# EAGLE design SensorManager (EAGLE 6.3)
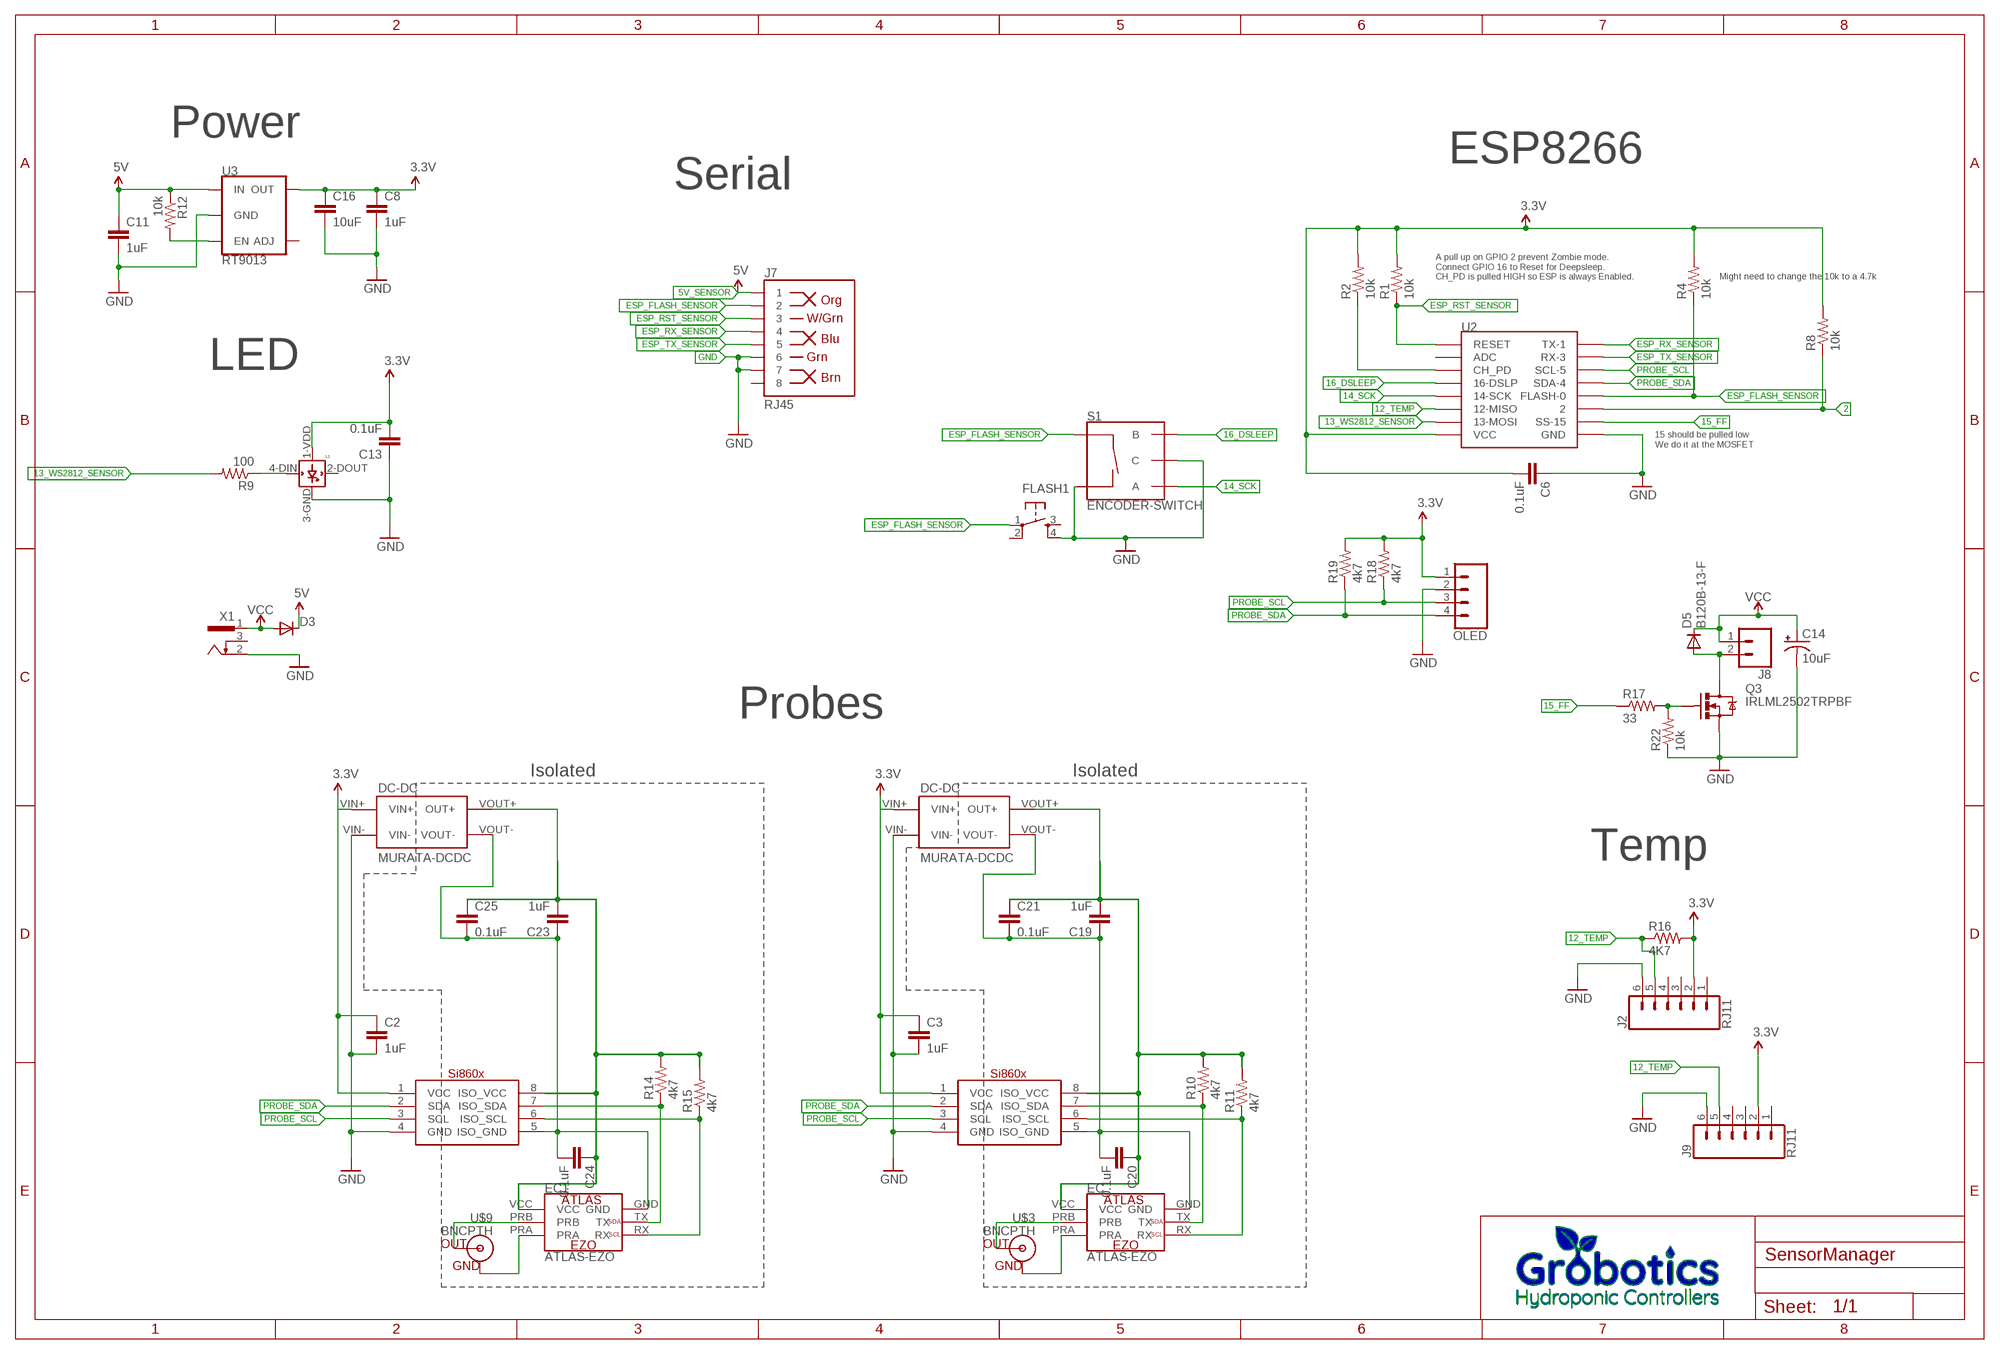
[diagram p0: schematic, sheet 1]

## Parts
C2  1uF  CAP0805  [0805]
C3  1uF  CAP0805  [0805]
C6  0.1uF  CAP0805  [0805]
C8  1uF  CAP0805  [0805]
C11  1uF  CAP0805  [0805]
C13  0.1uF  CAP0805  [0805]
C14  10uF  CPOL-US153CLV-0405  [153CLV-0405]
C16  10uF  CAP0805  [0805]
C19  1uF  CAP0805  [0805]
C20  0.1uF  CAP0805  [0805]
C21  0.1uF  CAP0805  [0805]
C23  1uF  CAP0805  [0805]
C24  0.1uF  CAP0805  [0805]
C25  0.1uF  CAP0805  [0805]
D3  DIODESOD  [SOD-323]
D5  B120B-13-F  DIODESMB  [SMB-DIODE]
EC  ATLAS-EZO  [ATLAS-EZO]
EC1  ATLAS-EZO  [ATLAS-EZO]
FLASH1  TAC_SWITCHSMD  [TACTILE_SWITCH_SMD]
J2  RJ11  RJ11-6  [RJ11-6]
J7  RJ45  RJ45-8  [RJ45-8]
J8  CONN_02  [1X02]
J9  RJ11  RJ11-6  [RJ11-6]
L1  WS2812B  [WS2812B]
OLED  CONN_04  [1X04]
Q3  IRLML2502TRPBF  MOSFET-NCHANNELSMD  [SOT23-3]
R1  10k  RESISTOR0805  [0805]
R2  10k  RESISTOR0805  [0805]
R4  10k  RESISTOR0805  [0805]
R8  10k  RESISTOR0805  [0805]
R9  100  RESISTOR0805  [0805]
R10  4k7  RESISTOR0805-RES  [0805]
R11  4k7  RESISTOR0805-RES  [0805]
R12  10k  RESISTOR0805  [0805]
R14  4k7  RESISTOR0805-RES  [0805]
R15  4k7  RESISTOR0805-RES  [0805]
R16  4K7  RESISTOR0805-RES  [0805]
R17  33  RESISTOR0805  [0805]
R18  4k7  RESISTOR0805  [0805]
R19  4k7  RESISTOR0805  [0805]
R22  10k  RESISTOR0805  [0805]
S1  ENCODER-SWITCH  [ROTARY_ENC_PLAIN]
U2  ESP12SMD  [ESP12-SMD]
U3  RT9013  AP2202-ADJ  [SOT23-5]
U$3  BNCPTH  [BNC]
U$4  MURATA-DCDC  [MURATA_DCDC]
U$8  SI860X  [SO08]
U$9  BNCPTH  [BNC]
U$11  SI860X  [SO08]
U$12  LOGO_GROBOTICS  [GROBOTICS]
U$14  MURATA-DCDC  [MURATA_DCDC]
X1  733980-62  [733980-62]

## Nets
2: R8.1 U2.GPIO2
3.3V: C2.1 C3.1 C6.2 C8.1 C13.2 C16.1 J2.2 J9.2 L1.1-VDD(VDD) OLED.1 R1.2 R2.2 R4.2 R8.2 R16.2 R18.2 R19.2 U2.VCC U3.5(OUT) U$4.VIN+ U$8.1(VCC) U$11.1(VCC) U$14.VIN+
5V_SENSOR: C11.1 D3.1(C) J7.1 R12.1 U3.1(IN) ; supply symbol labelled 5V
12_TEMP: J2.5 J9.5 R16.1 U2.GPIO12(12-MISO)
13_WS2812_SENSOR: R9.2 U2.GPIO13(13-MOSI)
14_SCK: S1.A U2.GPIO14(14-SCK)
15_FF: R17.1 U2.GPIO15(SS-15)
16_DSLEEP: S1.B U2.GPIO16(16-DSLP)
ESP_FLASH_SENSOR: FLASH1.1 J7.2 R4.1 S1.SW+ U2.GPIO0(FLASH-0)
ESP_RST_SENSOR: J7.3 R1.1 U2.RESET
ESP_RX_SENSOR: J7.4 U2.TXD0(TX-1)
ESP_TX_SENSOR: J7.5 U2.RXD0(RX-3)
GND: C2.2 C3.2 C6.1 C8.2 C11.2 C13.1 C14.- C16.2 FLASH1.4 J2.6 J7.6 J7.7 J9.6 L1.3-GND(GND) OLED.2 Q3.2(S) R22.1 S1.C S1.SW- U2.GND U3.2(GND) U$4.VIN- U$8.4(GND) U$11.4(GND) U$14.VIN- X1.2
N$2: EC.PRB U$3.S(OUT)
N$4: EC1.PRB U$9.S(OUT)
N$5: EC1.PRA U$9.GND
N$6: EC1.RX R15.1 U$11.6(ISO_SCL)
N$7: EC1.TX R14.1 U$11.7(ISO_SDA)
N$8: EC.PRA U$3.GND
N$10: R2.1 U2.CH_PD
N$11: L1.4-DIN(DIN) R9.1
N$12: EC.RX R11.1 U$8.6(ISO_SCL)
N$13: R12.2 U3.3(EN)
N$14: EC.TX R10.1 U$8.7(ISO_SDA)
N$15: C19.1 C20.2 C21.2 EC.GND U$4.VOUT- U$8.5(ISO_GND)
N$16: C19.2 C20.1 C21.1 EC.VCC R10.2 R11.2 U$4.VOUT+(OUT+) U$8.8(ISO_VCC)
N$17: C23.1 C24.2 C25.2 EC1.GND U$11.5(ISO_GND) U$14.VOUT-
N$19: Q3.1(G) R17.2 R22.2
N$25: C23.2 C24.1 C25.1 EC1.VCC R14.2 R15.2 U$11.8(ISO_VCC) U$14.VOUT+(OUT+)
N$29 [power]: D5.A J8.2 Q3.3(D)
PROBE_SCL: OLED.3 R18.1 U2.GPIO5(SCL-5) U$8.3(SCL) U$11.3(SCL)
PROBE_SDA: OLED.4 R19.1 U2.GPIO4(SDA-4) U$8.2(SDA) U$11.2(SDA)
VCC_SENSOR: C14.+ D3.2(A) D5.C J8.1 X1.1 ; supply symbol labelled VCC
Unconnected: FLASH1.2 FLASH1.3 J2.1 J2.3 J2.4 J7.8 J9.1 J9.3 J9.4 L1.2-DOUT(DOUT) U2.ADC U3.4(ADJ) X1.3

## Notes on the sheet
- Power
- ESP8266
- Serial
- A pull up on GPIO 2 prevent Zombie mode.
  Connect GPIO 16 to Reset for Deepsleep.
  CH_PD is pulled HIGH so ESP is always Enabled.
- Might need to change the 10k to a 4.7k
- LED
- 15 should be pulled low
  We do it at the MOSFET
- Probes
- Isolated | Isolated
- Temp

## Library data of the parts
C2 C3 C6 C8 C11 C13 C16 C19-C21 C23-C25 = SparkFun-Capacitors:CAP: Capacitor Standard 0603 ceramic capacitor, and 0.1" leaded capacitor.
C14 = adafruit:CPOL-US: POLARIZED CAPACITOR, American symbol
D3 D5 = SparkFun-DiscreteSemi:DIODE: Diode These are standard reverse protection diodes and small signal diodes. SMA package can handle up to about 1A. SOD-323 can handle about 200mA. What the SOD-323 package when ordering, there are some mfgs out there that are 5-pin packages.
EC EC1 = 1_Skips:ATLAS-EZO: Atlas Scientific Modules EC, pH, DO http://www.atlas-scientific.com/
FLASH1 = SparkFun-Electromechanical:TAC_SWITCH: Momentary Switch Button commonly used for reset or general input. Spark Fun Electronics SKU : COM-00097 SMT- SWCH-08247; PROD_ID: SWCH-08247
J2 J9 = SparkFun-Connectors:RJ11-6: RJ11 Jack - 6 pin Commonly found on CAT3 devices and some Microchip programmers. Here is the connector we sell at SparkFun: RJ11 6-Pin Connector <https://www.sparkfun.com/products/132> (PRT-00132) Datasheet <http://www.sparkfun.com/datasheets/Prototyping/Connectors/RJ11-Datasheet.pdf> It is used on this SparkFun product: SparkFun Weather Shield <https://www.sparkfun.com/products/12081> (DEV-12081) Weather Meters <https://www.sparkfun.com/products/8942> (SEN-08942); PROD_ID: CONN-08590; SF_ID: PRT-00132
J7 = SparkFun-Connectors:RJ45-8: RJ45 Jack - 8 pin Simple RJ45, 8-pin connection. Commonly used for Cat5, Cat5e, and Cat6 Ethernet cables. Here is the connector we sell at SparkFun: RJ45 8-Pin Connector <https://www.sparkfun.com/products/643> (PRT-00643) Datasheet <https://cdn.sparkfun.com/datasheets/Prototyping/04908.pdf> It is used on this SparkFun product: SparkFun RJ45 Breakout <https://www.sparkfun.com/products/716> (BOB-00716) Note, you may also be interested in the "MAGJACK" version of this. It is basically a RJ45 connector, but also has some status LEDs built into the connector housing. You can check that out in this library at the device named "MAGJACK.dev" and see these products online: RJ45 Ethernet MagJack-Compatible <https://www.sparkfun.com/products/8534> (PRT-08534) SparkFun RJ45 MagJack Breakout <https://www.sparkfun.com/products/13021> (BOB-13021); PROD_ID: CONN-08506; SF_ID: PRT-00643
J8 = SparkFun-Connectors:CONN_02: Multi connection point. Often used as Generic Header-pin footprint for 0.1 inch spaced/style header connections On any of the 0.1 inch spaced packages, you can populate with these: Break Away Headers - Straight <https://www.sparkfun.com/products/116> (PRT-00116) Break Away Male Headers - Right Angle <https://www.sparkfun.com/products/553> (PRT-00553) Female Headers <https://www.sparkfun.com/products/115> (PRT-00115) Break Away Headers - Machine Pin <https://www.sparkfun.com/products/117> (PRT-00117) Break Away Female Headers - Swiss Machine Pin <https://www.sparkfun.com/products/743> (PRT-00743) For SCREWTERMINALS and SPRING TERMINALS visit here: Screw Terimnals on SparkFun.com <https://www.sparkfun.com/search/results?term=Screw+Terminals> (5mm/3.5mm/2.54mm spacing) This device is also useful as a general connection point to wire up your design to another part of your project. Our various solder wires solder well into these plated through hole pads. Hook-Up Wire - Assortment (Stranded, 22 AWG) <https://www.sparkfun.com/products/11375> (PRT-11375) Hook-Up Wire - Assortment (Solid Core, 22 AWG) <https://www.sparkfun.com/products/11367> (PRT-11367) View the entire wire category on our website here <https://www.sparkfun.com/categories/141> Special notes: Molex polarized connector foot print use with: PRT-08233 with associated crimp pins and housings. 2.54_SCREWTERM for use with PRT-10571. 3.5mm Screw Terminal footprints for PRT-08084 5mm Screw Terminal footprints for use with PRT-08432
L1 = adafruit:WS2812B
OLED = SparkFun-Connectors:CONN_04: Multi connection point. Often used as Generic Header-pin footprint for 0.1 inch spaced/style header connections On any of the 0.1 inch spaced packages, you can populate with these: Break Away Headers - Straight <https://www.sparkfun.com/products/116> (PRT-00116) Break Away Male Headers - Right Angle <https://www.sparkfun.com/products/553> (PRT-00553) Female Headers <https://www.sparkfun.com/products/115> (PRT-00115) Break Away Headers - Machine Pin <https://www.sparkfun.com/products/117> (PRT-00117) Break Away Female Headers - Swiss Machine Pin <https://www.sparkfun.com/products/743> (PRT-00743) For SCREWTERMINALS and SPRING TERMINALS visit here: Screw Terimnals on SparkFun.com <https://www.sparkfun.com/search/results?term=Screw+Terminals> (5mm/3.5mm/2.54mm spacing) This device is also useful as a general connection point to wire up your design to another part of your project. Our various solder wires solder well into these plated through hole pads. Hook-Up Wire - Assortment (Stranded, 22 AWG) <https://www.sparkfun.com/products/11375> (PRT-11375) Hook-Up Wire - Assortment (Solid Core, 22 AWG) <https://www.sparkfun.com/products/11367> (PRT-11367) View the entire wire category on our website here <https://www.sparkfun.com/categories/141> Special notes: Molex polarized connector foot print use with SKU : PRT-08231 with associated crimp pins and housings. 1MM SMD Version SKU: PRT-10208; PROD_ID: CONN-09696
Q3 = freetronics-master-v1.1:MOSFET-NCHANNEL
R1 R2 R4 R8 R9 R12 R17-R19 R22 = LowPowerLab:RESISTOR: Resistor Basic schematic elements and footprints for 0603, 1206, and PTH resistors.
R10 R11 R14-R16 = SparkFun-Resistors:RESISTOR: Resistor Basic schematic elements and footprints for 0603, 1206, and PTH resistors.
S1 = SparkFun-Switches:ENCODER-SWITCH: Rotary Encoder w/ Select Switch Encoders rotate similarly to potentiometers, but they’re different from potentiometers in that an encoder has full rotation without limits. They output gray code so that you can tell how much and in which direction the encoder has been turned. This encoder includes a push-down select switch built into the shaft. SparkFun Products Rotary Encoder <https://www.sparkfun.com/products/9117> (COM-09117); SF_SKU: COM-09117
U2 = esp8266modules:ESP12: ESP8266 Wifi module 12
U3 = SparkFun-IC-Power:AP2202-ADJ: AP2202 Adjustable LDO Diodes Inc small, low-cost LDO 150mA, 13.2V, less than 200mV dropout; PROD_ID: VREG-12189; VALUE: AP2202-ADJ
U$3 U$9 = SparkFun-Connectors:BNC: BNC Connector, Mouser Part# 5227161
U$4 U$14 = 11_Skips_Refactor:MURATA-DCDC: Isolated DC-DC convertor by Murata Recommend: 22uH/10uF LC filter on OUTPUT 4.7uF/15uH LC filter on INPUT LOAD HAS TO BE > 10% OF RATED POWER http://power.murata.com/data/power/ncl/kdc_nxe2.pdf
U$8 U$11 = 1_Skips:SI860X: Silicon Labs - Si860x http://au.element14.com/silicon-labs/si8600ab-b-is/digital-isolator-20ns-nsoic-8/dp/2423221 The SI8600AB-B-IS is a bidirectional I²C Isolator with unidirectional digital channels. It is designed based on Silicon Labs proprietary RF isolation technology and offers shorter propagation delays, lower power consumption, smaller installed size and more stable operation with temperature and age versus optocouplers or other digital isolators. It includes hot-swap bidirectional SDA and/or SCL isolation channels with open-drain, 35mA sink capability that operate to a maximum frequency of 1.7MHz. It contains protection circuits to guard against data errors when an unpowered device is inserted into a powered system. Small size, low installed cost, low power consumption and short propagation delays make the Si860x family the optimum solution for isolating I²C and SMBus serial ports. Independent bidirectional SDA and SCL isolation channels Open drain outputs with 35mA sink current Up to 5000VRMS isolation 60-year Life at rated working voltage High electromagnetic immunity (EMI) Transient immunity 50 kV/µs AEC Qualified
U$12 = 1_Skips:LOGO_GROBOTICS
X1 = con-conrad:73398?: FEMALE PRINT CONNECTOR Niedervolt-Steckverbinder Distributor Conrad

## Net classes
1 power: width 0.381 mm, clearance 0.254 mm

## Board
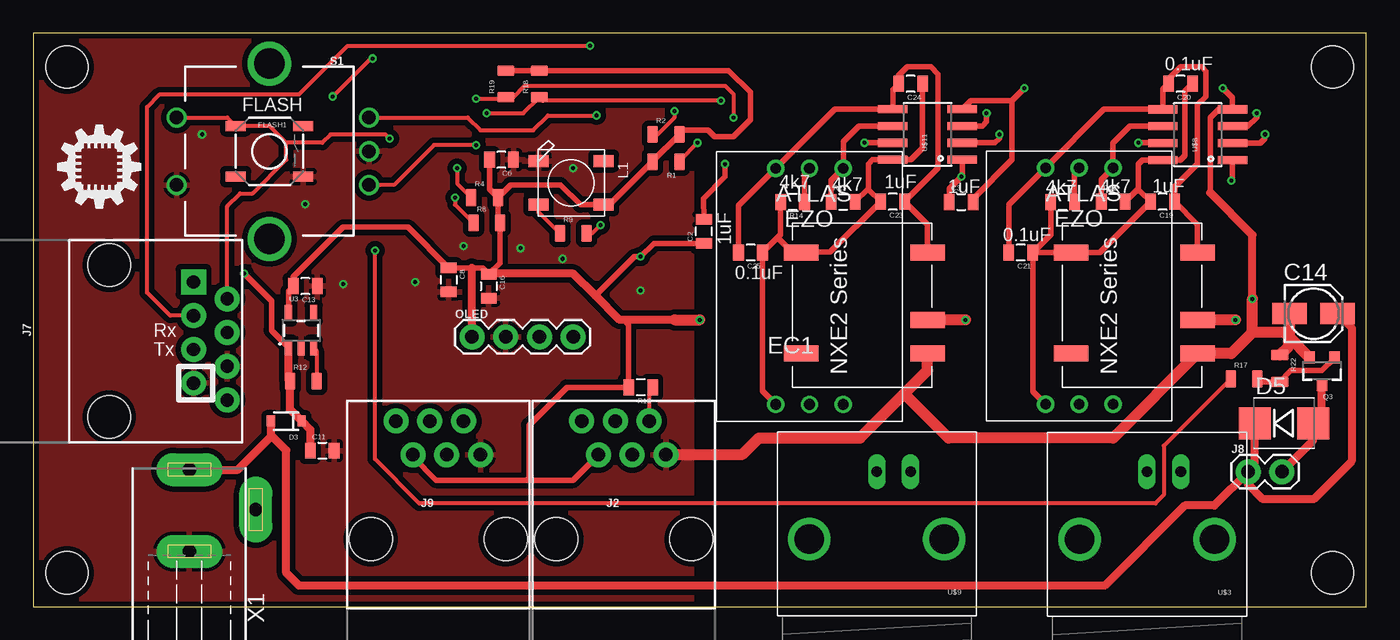
[diagram p1: board, top side]
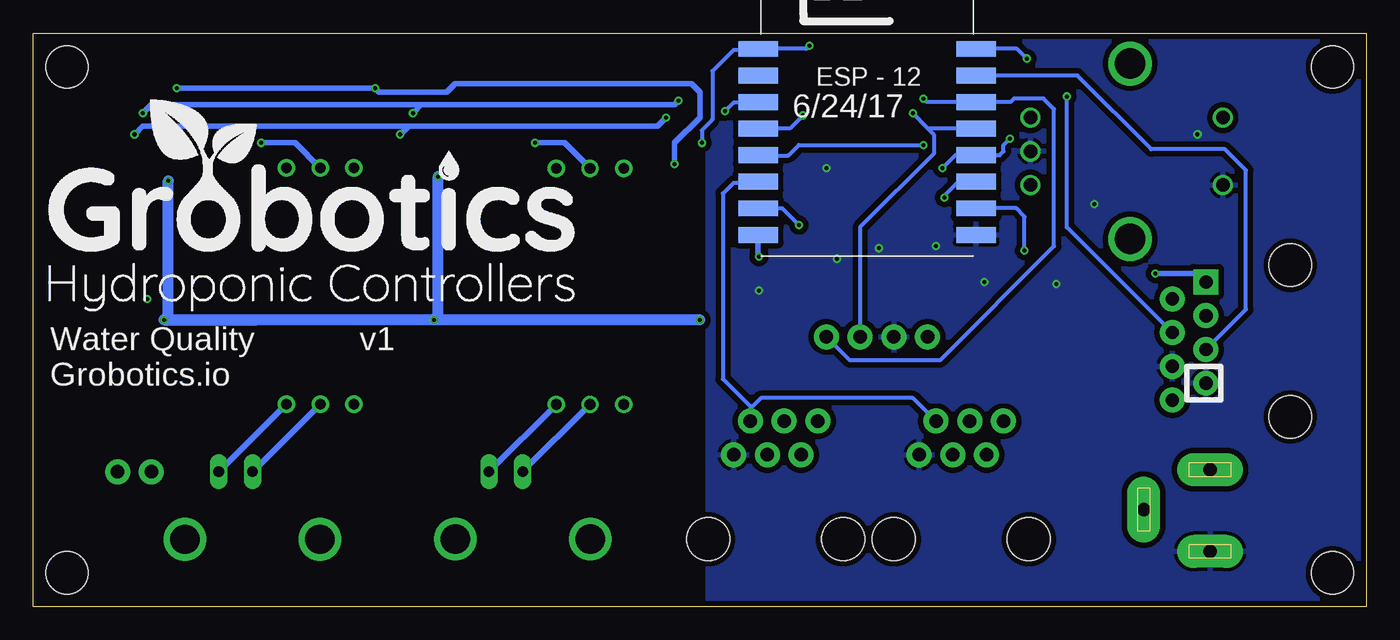
[diagram p2: board, bottom side, seen from below]

Size 100.33 x 43.18 mm. Coordinates in mm from the lower left corner, seen from the top.
Outline: 0,0 100.33,0 100.33,43.18 0,43.18 0,0
Copper layers (1*16): Top 0.035mm / dielectric 1.5mm / Bottom 0.035mm
Design rules "dirt_cheap_dirty_boards.v1": minimum track width 5mil, minimum drill 12mil, track to track 5mil, track to pad 5mil, pad to pad 5mil, via to via 5mil, smd to smd 0mil, copper to edge 10mil, drill to drill 10mil, minimum pad ring 10mil, minimum via ring 6mil, stop-mask expansion 2mil, vias tented up to drill 25mil, thermal gap 10mil
Holes 3.2 mm at 2.54,2.54 97.79,2.54 97.79,40.64 2.54,40.64

### Footprints (pad centres in the part's own frame; a part is rotated, then mirrored left to right if it is on the bottom)
0805 = smd 0.8 x 1.2: 1 -0.9,0; 2 0.9,0
153CLV-0405 = smd 2.6 x 1.6: + 1.8,0; - -1.8,0
SOD-323 = smd 0.63 x 0.83: 1 -1.15,0; 2 1.15,0
SMB-DIODE = smd 2.4 x 2.4: A 2.2,0; C -2.2,0
ATLAS-EZO = drill 0.8: GND -2.54,8.89; PRA 2.54,-8.89; PRB 0,-8.89; RX 2.54,8.89; TX 0,8.89; VCC -2.54,-8.89
TACTILE_SWITCH_SMD = smd 1.524 x 0.762: 1 -2.54,1.905; 2 2.54,1.905; 3 -2.54,-1.905; 4 2.54,-1.905
RJ11-6 = drill 1.016 pad 1.88: 1 -3.175,8.89; 2 -1.905,6.35; 3 -0.635,8.89; 4 0.635,6.35; 5 1.905,8.89; 6 3.175,6.35 | hole 3.251: -5.08,0; 5.08,0
RJ45-8 = drill 1 pad 1.88 square: 1 -4.445,6.35 | drill 1 pad 1.88: 2 -3.175,8.89; 3 -1.905,6.35; 4 -0.635,8.89; 5 0.635,6.35; 6 1.905,8.89; 7 3.175,6.35; 8 4.445,8.89 | hole 3.2: -5.715,0; 5.715,0
1X02 = drill 1.016 pad 1.88: 1 0,0; 2 2.54,0
WS2812B = smd 1.5 x 0.9: 1-VDD 2.45,-1.65; 2-DOUT 2.45,1.65; 3-GND -2.45,1.65; 4-DIN -2.45,-1.65
1X04 = drill 1.016 pad 1.88: 1 0,0; 2 2.54,0; 3 5.08,0; 4 7.62,0
SOT23-3 = smd 0.8 x 0.9: 1 -0.95,-1; 2 0.95,-1; 3 0,1.1
0805' = smd 0.8 x 1.3: 1 -1,0; 2 1,0
ROTARY_ENC_PLAIN = drill 1.016: A 7.493,-2.54; B 7.493,2.54; C 7.493,0; SW+ -6.985,2.54; SW- -6.985,-2.54 | drill 2.286: P$3 0,6.604; P$4 0,-6.604
ESP12-SMD = smd 3 x 1.2: ADC -8.3,3.8; CH_PD -8.3,1.8; GND 8.1,-8.2; GPIO0 8.1,-2.2; GPIO2 8.1,-4.2; GPIO4 8.1,1.8; GPIO5 8.1,-0.2; GPIO12 -8.3,-4.2; GPIO13 -8.3,-6.2; GPIO14 -8.3,-2.2; GPIO15 8.1,-6.2; GPIO16 -8.3,-0.2; RESET -8.3,5.8; RXD0 8.1,3.8; TXD0 8.1,5.8; VCC -8.3,-8.2
SOT23-5 = smd 0.55 x 1.2: 1 -0.95,-1.3; 2 0,-1.3; 3 0.95,-1.3; 4 0.95,1.3; 5 -0.95,1.3
BNC = drill 2.2: 3 -5.08,5.08; 4 5.08,5.08 | drill 0.8 long: GND -2.54,0; S 0,0
MURATA_DCDC = smd 1.2 x 2.6: NC 0,9.525; VIN+ 2.54,0; VIN- 0,0; VOUT+ 7.62,9.525; VOUT- 7.62,0
SO08 = smd 0.61 x 2.21: 1 -1.905,-2.616; 2 -0.635,-2.616; 3 0.635,-2.616; 4 1.905,-2.616; 5 1.905,2.616; 6 0.635,2.616; 7 -0.635,2.616; 8 -1.905,2.616
733980-62 = drill 1 pad 2.5 long: 1 0,8.57; 2 0,2.42; 3 5,5.57

### Placement (x,y rotation side)
C2  50.48,28.26 90 top
C3  69.85,30.48 0 top
C6  35.24,33.66 180 top
C8  31.27,24.61 270 top
C11  21.75,11.75 0 top
C13  20.48,24.13 180 top
C14  96.36,22.07 0 top
C16  34.29,24.13 270 top
C19  85.01,30.49 180 top
C20  86.34,39.37 180 top
C21  74.32,26.66 180 top
C23  64.69,30.49 180 top
C24  66.03,39.37 180 top
C25  53.98,26.66 180 top
D3  19.05,13.97 180 top
D5  94.14,13.81 0 top
EC  78.73,24.14 0 top
EC1  58.42,24.12 0 top
FLASH1  17.78,34.29 0 top
J2  44.45,5.08 0 top
J7  5.71,20 270 top
J8  91.44,10.16 0 top
J9  30.48,5.08 0 top
L1  40.48,31.91 0 top
OLED  33.02,20.32 0 top
Q3  97,17.78 180 top
R1  10k  [0805']  47.62,33.5 180 top
R2  10k  [0805']  47.62,35.56 0 top
R4  10k  [0805']  33.97,30.8 0 top
R8  10k  [0805']  34.13,28.89 0 top
R9  100  [0805']  40.64,28.1 0 top
R10  77.48,30.48 180 top
R11  81.29,30.48 0 top
R12  10k  [0805']  20.32,16.99 0 top
R14  57.15,30.47 180 top
R15  60.95,30.48 0 top
R16  45.72,16.51 180 top
R17  33  [0805']  91.12,17.14 0 top
R18  4k7  [0805']  38.1,39.37 90 top
R19  4k7  [0805']  35.56,39.37 90 top
R22  10k  [0805']  93.82,17.94 270 top
S1  17.78,34.29 0 top
U2  37.47,36.2 0 bottom
U3  20.16,20.8 0 top
U$3  83.83,10.16 180 top
U$4  87.63,19.05 90 top
U$8  87.64,35.54 90 top
U$9  63.49,10.17 180 top
U$11  67.31,35.56 90 top
U$12  99.06,22.86 0 bottom
U$13  [ID_LOGO_X0.25]  1.75,29.84 0 top
U$14  67.31,19.05 90 top
X1  11.75,1.75 0 top

### Tracks (layer width: path | path; a pad name or v marks a point on that pad's centre or on a via)
2  (via drill 0.3)
  Top 0.305: v31.75,30.8 31.75,30.27 R8.1
  Bottom 0.305: U2.GPIO2 29.45,31.91 30.8,31.91 31.75,30.96 v31.75,30.8
3.3V  (via drill 0.3)
  Top 0.406: v90.17,32.07 90.25,32.15 U$8.1 | C3.1 68.95,31.48 v69.85,32.38 69.92,32.46 U$11.1 | U3.5 19.21,23.76 C13.2 19.58,24.82 23.34,28.57 28.2,28.57 C8.1 33.02,25.51 33.81,25.51 C16.1 35.13,25.87 R8.2 34.97,29.05 R4.2 | R4.2 34.34,31.43 C6.2 | R4.2 35.92,31.75 39.69,31.75 41.18,30.26 L1.1-VDD 43.39,30.26 R1.2 46.62,33.56 R2.2 48.94,35.88 50.8,35.88 51.28,35.4 52.7,35.4 53.98,36.67 53.98,38.73 52.34,40.37 R18.2 R19.2 | J9.2 28.57,11.27 30.32,9.53 37.15,9.53 | 37.15,9.53 40.64,9.53 J2.2 | 44.45,21.59 44.82,21.22 R16.2 40.16,16.51 37.31,13.65 37.31,9.68 37.15,9.53 | 42.31,23.42 45.24,26.35 v45.72,26.35 46.73,27.36 C2.1
  Top 0.61: 70.15,21.61 v70.17,21.59 | 48.28,21.59 44.45,21.59 44.13,21.59 42.31,23.42 40.64,25.08 34.34,25.08 C16.1 | OLED.1 33.02,25.51
  Top 0.813: 48.28,21.59 v50.16,21.59 | v70.17,21.59 U$14.VIN+ | v90.49,21.59 U$4.VIN+
  Bottom 0.406: U2.VCC 45.77,26.4 v45.72,26.35
  Bottom 0.813: v50.16,21.59 v70.17,21.59 | v70.17,21.59 v90.49,21.59 | v90.49,21.59 83.5,21.59 | v70.17,21.59 69.85,21.91 v69.85,32.38 | v90.49,21.59 90.17,21.91 v90.17,32.07
5V_SENSOR  (via drill 0.3)
  Top 0.406: v15.88,25.08 17.94,23.02 17.94,20.8 19.21,19.52 U3.1
  Top 0.61: C11.1 20.85,13.32 D3.1 19.32,14.85 R12.1 19.21,17.09 U3.1
  Bottom 0.406: J7.1 12.7,25.08 v15.88,25.08
12_TEMP
  Top 0.305: R16.1 46.35,16.77 J2.5
  Bottom 0.305: U2.GPIO12 45.85,31.91 47.62,31.91 48.42,31.11 48.42,17.14 46.35,15.08 | 46.35,15.08 J2.5 | J9.5 34.13,15.72 45.56,15.72 46.2,15.08 46.35,15.08
13_WS2812_SENSOR  (via drill 0.3)
  Top 0.305: v42.7,28.73 42.07,28.1 R9.2
  Bottom 0.305: U2.GPIO13 45.76,30 43.97,30 v42.7,28.73
14_SCK  (via drill 0.3)
  Top 0.305: v33.34,34.77 30.16,34.77 27.15,31.75 S1.A
  Bottom 0.305: U2.GPIO14 45.74,33.97 43.5,33.97 42.7,34.77 v33.34,34.77
15_FF  (via drill 0.3)
  Top 0.305: R17.1 85.09,12.11 85.09,8.41 84.45,7.78 29.05,7.78 25.72,11.11 v25.72,26.83
  Bottom 0.305: v25.72,26.83 25.72,29.37 26.34,30 U2.GPIO15
16_DSLEEP  (via drill 0.3)
  Top 0.305: S1.B 32.7,36.83 33.66,35.88 37.62,35.88 38.73,36.99 v42.39,36.99
  Bottom 0.305: v42.39,36.99 43.38,35.99 U2.GPIO16
ESP_FLASH_SENSOR  (via drill 0.3)
  Top 0.305: S1.SW+ 14.61,36.83 FLASH1.1 17.78,36.2 19.05,34.92 | v31.91,33.02 31.91,31.86 R4.1 | v26.83,35.24 26.51,35.56 22.38,35.56 21.75,34.92 19.05,34.92 | J7.2 14.61,30.16 15.56,31.11 16.51,31.11 19.05,33.66 19.05,34.92
  Bottom 0.305: v31.91,33.02 30.93,33.99 U2.GPIO0 27.6,33.99 27.3,34.29 27.3,34.77 v26.83,35.24
ESP_RST_SENSOR  (via drill 0.3)
  Top 0.305: v50.01,34.92 48.62,33.54 R1.1 | J7.3 10.32,21.91 8.57,23.65 8.57,37.62 9.53,38.58 20,38.58 23.65,42.23 v41.91,42.23
  Bottom 0.305: v50.01,34.92 50.01,35.88 49.21,36.67 49.21,40.32 47.62,41.91 45.85,41.91 U2.RESET 42.14,41.99 v41.91,42.23
ESP_RX_SENSOR  (via drill 0.3)
  Top 0.305: v22.54,38.42 25.4,41.27 v25.56,41.27
  Bottom 0.305: J7.4 22.54,28.57 v22.54,38.42 | v25.56,41.27 26.28,41.99 U2.TXD0
ESP_TX_SENSOR
  Bottom 0.305: J7.5 9.05,22.38 9.05,32.86 10.64,34.45 16.19,34.45 21.74,39.99 U2.RXD0
GND  (via drill 0.3)
  Top 0.406: v89.53,39.05 90.25,38.33 U$8.4 90.23,37.47 89.22,37.47 88.58,36.83 88.58,31.17 | v74.61,39.05 73.66,38.1 | 73.66,38.1 70.56,38.1 U$11.4 | C3.2 70.75,30.75 73.66,33.66 73.66,38.1 | v52.07,33.34 52.07,32.38 50.43,30.75 C2.2
  Top 0.61: v91.76,23.18 91.76,27.99 88.58,31.17
  Top 0.813: 91.76,20.64 v91.76,23.18 | Q3.2 94.56,20.27 | 94.56,20.27 C14.- | 94.56,20.27 94.48,20.34 | 94.48,20.34 94.19,20.64 91.76,20.64 | R22.1 94.48,19.6 94.48,20.34 | J2.6 53.34,11.43 54.61,12.7 62.23,12.7 65.72,16.19 | 91.76,20.64 90.17,19.05 U$4.VIN- 81.28,12.7 68.9,12.7 65.72,15.88 65.72,16.19 | 65.72,16.19 67.31,17.78 U$14.VIN-
  Bottom 0.406: v89.53,39.05 v74.61,39.05 74.3,38.73 69.22,38.73 68.58,39.37 50.8,39.37 50.16,38.73 50.16,36.83 52.07,34.92 v52.07,33.34
  other vias: 12.7,35.56 32.38,27.15 20.48,30.32 23.34,24.29 28.73,24.45 36.67,26.99 39.85,26.19 40.64,33.02 45.72,23.81
  pour Top (isolate 0.406): 0,0 49.53,0 49.53,43.18 0,43.18
  pour Bottom (isolate 0.406): 0,0 49.53,0 49.53,43.18 0,43.18
N$2
  Bottom 0.406: EC.PRB 78.75,15.23 U$3.S
N$4
  Bottom 0.406: EC1.PRB 58.41,15.21 U$9.S
N$5
  Bottom 0.406: EC1.PRA 60.95,15.21 U$9.GND
N$6
  Top 0.406: R15.1 60.05,32.1 EC1.RX 60.96,35.01 62.15,36.2 U$11.6
N$7  (via drill 0.3)
  Top 0.406: R14.1 58.05,32.63 EC1.TX | U$11.7 v62.55,34.92
  Bottom 0.406: v62.55,34.92 60.34,34.92 EC1.TX
N$8
  Bottom 0.406: EC.PRA 81.29,15.23 U$3.GND
N$10  (via drill 0.3)
  Top 0.305: v48.26,37.31 48.26,36.83 46.99,35.56 R2.1
  Bottom 0.305: U2.CH_PD 45.82,37.94 47.62,37.94 v48.26,37.31
N$11
  Top 0.305: R9.1 38.03,29.71 L1.4-DIN
N$12
  Top 0.406: R11.1 80.39,32.15 EC.RX 81.27,34.91 82.55,36.2 85,36.2 U$8.6
N$13
  Top 0.305: U3.3 21.32,19.29 R12.2
N$14  (via drill 0.3)
  Top 0.406: R10.1 78.38,32.68 EC.TX | U$8.7 85,34.92 v83.19,34.92
  Bottom 0.406: v83.19,34.92 80.62,34.92 EC.TX
N$15
  Top 0.406: C21.2 73.42,30.27 EC.GND 80.59,37.44 U$8.5 85.02,38.95 C20.2 85.44,39.73 86.36,40.64 87.95,40.64 88.27,40.32 88.27,38.42 87.63,37.78 87.63,33.34 85.91,31.62 C19.1 87.63,28.77 U$4.VOUT-
N$16
  Top 0.406: R11.2 83,31.3 | 83,31.3 83.19,31.48 83.19,33.34 83.48,33.63 U$8.8 | 85.05,33.66 U$8.8 | C20.1 86.68,38.8 86.68,33.97 86.34,33.63 U$8.8 | C21.1 76.58,28.02 R10.2 | 78.73,26.66 C21.1 | EC.VCC 75.22,16.22 C21.1 | 83,31.3 83.3,31.3 C19.2 80.29,26.67 78.74,26.67 78.73,26.66 | U$4.VOUT+ 78.73,26.67 78.73,26.66
N$17
  Top 0.406: C25.2 53.09,30.21 EC1.GND 60.34,37.46 U$11.5 64.69,38.93 C24.2 65.13,39.97 65.8,40.64 67.55,40.64 68.1,40.08 68.1,33.01 C23.1 67.31,28.77 U$14.VOUT-
N$19
  Top 0.406: Q3.1 97.95,18.73 97,17.78 94.66,17.78 R22.2 92.33,16.94 R17.2
N$25
  Top 0.406: 62.87,31.5 62.87,33.34 63.18,33.65 U$11.8 66.04,33.66 66.93,34.54 C24.1 | 62.87,31.5 R15.2 | 54.88,26.69 C25.1 | EC1.VCC 54.88,16.23 C25.1 | C25.1 56.02,27.8 | 56.02,27.8 56.25,28.03 R14.2 | 62.87,31.5 62.87,31.41 C23.2 59.98,26.69 57.78,26.69 U$14.VOUT+ 57.15,26.67 56.02,27.8
N$29
  Top 0.61: J8.2 96.34,12.52 D5.A 97,14.47 Q3.3
PROBE_SCL  (via drill 0.3)
  Top 0.305: v34.13,37.15 36.88,37.15 R18.1 38.37,38.1 v51.75,38.1
  Top 0.406: v92.08,37.15 92.08,36.83 91.42,36.17 U$8.3 | U$11.3 71.44,36.2 71.75,36.51 v71.75,37.15
  Bottom 0.305: U2.GPIO5 32.98,35.99 | 32.98,35.99 v34.13,37.15 | 32.98,35.99 32.54,35.56 32.54,34.13 38.1,28.57 OLED.3
  Bottom 0.406: v51.75,38.1 52.07,37.78 71.12,37.78 | 71.12,37.78 91.44,37.78 v92.08,37.15 | v71.75,37.15 71.12,37.78
PROBE_SDA  (via drill 0.3)
  Top 0.305: v33.34,38.26 35.45,38.26 R19.1 36.15,38.37 36.99,39.21 52.07,39.21 52.7,38.58 v52.7,36.83
  Top 0.406: v92.71,35.56 92.71,35.24 92.37,34.9 U$8.2 | U$11.2 72.39,34.92 72.71,35.24 v72.71,35.56
  Bottom 0.305: v33.34,38.26 33.07,37.99 U2.GPIO4 26.77,37.99 26.51,38.26 24.29,38.26 23.5,37.47 23.5,27.15 32.07,18.57 38.89,18.57 OLED.4
  Bottom 0.406: v52.7,36.83 53.34,36.2 72.07,36.2 | 72.07,36.2 92.08,36.2 v92.71,35.56 | v72.71,35.56 72.07,36.2
VCC_SENSOR
  Top 0.61: J8.1 91.94,10.66 D5.C | C14.+ 99.22,21.01 99.22,10.95 96.36,8.1 92.55,8.1 91.44,9.21 J8.1 | J8.1 88.9,7.62 86.68,7.62 80.64,1.59 20,1.59 19.05,2.54 19.05,11.78 17.95,12.87 | D3.2 17.9,12.93 17.95,12.87 | X1.1 15.4,10.32 17.95,12.87

### Text on the board
tPlace: FLASH | 4k7 | Rx | Tx
bPlace: 6/24/17 | Water Quality v1 / Grobotics.io